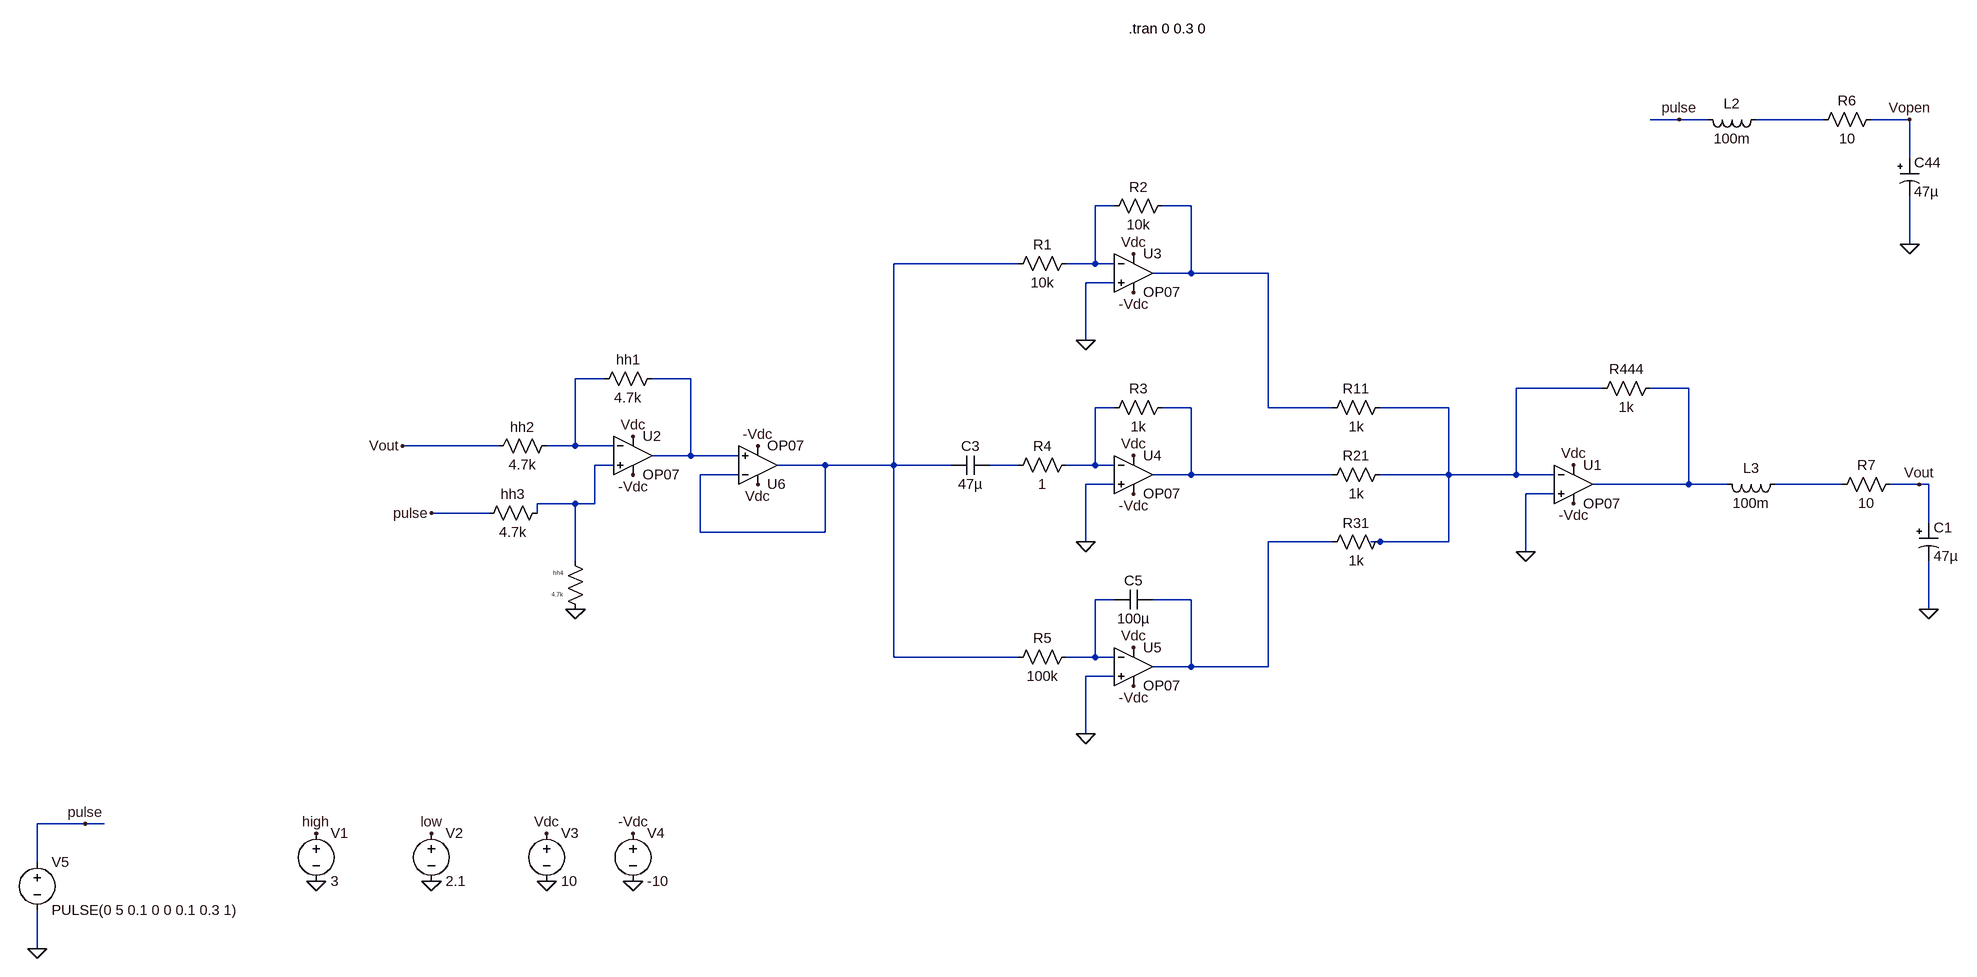
[diagram p0: schematic PID.asc]
PID.asc, the LTspice schematic file:
Version 4
SHEET 1 1540 1184
WIRE 1008 -512 960 -512
WIRE 1056 -512 1008 -512
WIRE 1248 -512 1136 -512
WIRE 1392 -512 1328 -512
WIRE 1392 -448 1392 -512
WIRE -240 -368 -272 -368
WIRE -112 -368 -160 -368
WIRE 1392 -304 1392 -384
WIRE -400 -272 -608 -272
WIRE -272 -272 -272 -368
WIRE -272 -272 -320 -272
WIRE -240 -272 -272 -272
WIRE -112 -256 -112 -368
WIRE -112 -256 -176 -256
WIRE 160 -256 -112 -256
WIRE -240 -240 -288 -240
WIRE -288 -144 -288 -240
WIRE -1312 -80 -1360 -80
WIRE -1168 -80 -1232 -80
WIRE 880 -64 736 -64
WIRE 1024 -64 960 -64
WIRE -240 -32 -272 -32
WIRE -112 -32 -160 -32
WIRE 160 -32 160 -256
WIRE 368 -32 160 -32
WIRE 624 -32 448 -32
WIRE -1488 32 -1648 32
WIRE -1360 32 -1360 -80
WIRE -1360 32 -1408 32
WIRE -1296 32 -1360 32
WIRE -1168 48 -1168 -80
WIRE -1168 48 -1232 48
WIRE -1088 48 -1168 48
WIRE -1296 64 -1328 64
WIRE -944 64 -1024 64
WIRE -608 64 -608 -272
WIRE -608 64 -944 64
WIRE -512 64 -608 64
WIRE -400 64 -448 64
WIRE -272 64 -272 -32
WIRE -272 64 -320 64
WIRE -240 64 -272 64
WIRE -1088 80 -1152 80
WIRE -112 80 -112 -32
WIRE -112 80 -176 80
WIRE 368 80 -112 80
WIRE 624 80 624 -32
WIRE 624 80 448 80
WIRE 736 80 736 -64
WIRE 736 80 624 80
WIRE 800 80 736 80
WIRE -240 96 -288 96
WIRE 1024 96 1024 -64
WIRE 1024 96 864 96
WIRE 1088 96 1024 96
WIRE 1280 96 1168 96
WIRE 1408 96 1360 96
WIRE 1424 96 1408 96
WIRE 800 112 752 112
WIRE -1360 128 -1424 128
WIRE -1328 128 -1328 64
WIRE -1328 128 -1360 128
WIRE -1504 144 -1600 144
WIRE -1424 144 -1424 128
WIRE 1424 160 1424 96
WIRE -1152 176 -1152 80
WIRE -944 176 -944 64
WIRE -944 176 -1152 176
WIRE -288 192 -288 96
WIRE 368 192 160 192
WIRE 448 192 432 192
WIRE 624 192 624 80
WIRE 624 192 448 192
WIRE 752 208 752 112
WIRE -1360 224 -1360 128
WIRE -240 288 -272 288
WIRE -112 288 -176 288
WIRE 1424 304 1424 224
WIRE -608 384 -608 64
WIRE -400 384 -608 384
WIRE -272 384 -272 288
WIRE -272 384 -320 384
WIRE -240 384 -272 384
WIRE -112 400 -112 288
WIRE -112 400 -176 400
WIRE 160 400 160 192
WIRE 160 400 -112 400
WIRE -240 416 -288 416
WIRE -288 512 -288 416
WIRE -2432 960 -2512 960
WIRE -2400 960 -2432 960
WIRE -2512 1024 -2512 960
WIRE -2512 1168 -2512 1104
FLAG 752 208 0
FLAG -1792 1056 0
FLAG -1792 976 high
FLAG -1600 1056 0
FLAG -1600 976 low
FLAG -1408 1056 0
FLAG -1408 976 Vdc
FLAG -1264 1056 0
FLAG -1264 976 -Vdc
FLAG 832 64 Vdc
FLAG 832 128 -Vdc
FLAG -208 -288 Vdc
FLAG -208 -224 -Vdc
FLAG -288 -144 0
FLAG -208 48 Vdc
FLAG -208 112 -Vdc
FLAG -288 192 0
FLAG -208 368 Vdc
FLAG -208 432 -Vdc
FLAG -288 512 0
FLAG -2512 1168 0
FLAG -2432 960 pulse
FLAG -1360 304 0
FLAG -1264 16 Vdc
FLAG -1600 144 pulse
FLAG -1264 80 -Vdc
FLAG -1056 96 Vdc
FLAG -1056 32 -Vdc
FLAG -1648 32 Vout
FLAG 1392 -304 0
FLAG 1008 -512 pulse
FLAG 1424 304 0
FLAG 1408 96 Vout
FLAG 1392 -512 Vopen
SYMBOL res 464 -48 R90
WINDOW 0 0 56 VBottom 2
WINDOW 3 32 56 VTop 2
SYMATTR InstName R11
SYMATTR Value 1k
SYMBOL res 464 64 R90
WINDOW 0 0 56 VBottom 2
WINDOW 3 32 56 VTop 2
SYMATTR InstName R21
SYMATTR Value 1k
SYMBOL res 464 176 R90
WINDOW 0 0 56 VBottom 2
WINDOW 3 32 56 VTop 2
SYMATTR InstName R31
SYMATTR Value 1k
SYMBOL Opamps/OP07 832 32 R0
SYMATTR InstName U1
SYMBOL voltage -1792 960 R0
SYMATTR InstName V1
SYMATTR Value 3
SYMBOL voltage -1600 960 R0
SYMATTR InstName V2
SYMATTR Value 2.1
SYMBOL voltage -1408 960 R0
SYMATTR InstName V3
SYMATTR Value 10
SYMBOL voltage -1264 960 R0
SYMATTR InstName V4
SYMATTR Value -10
SYMBOL res 976 -80 R90
WINDOW 0 0 56 VBottom 2
WINDOW 3 32 56 VTop 2
SYMATTR InstName R444
SYMATTR Value 1k
SYMBOL Opamps/OP07 -208 -320 R0
SYMATTR InstName U3
SYMBOL res -304 -288 R90
WINDOW 0 0 56 VBottom 2
WINDOW 3 32 56 VTop 2
SYMATTR InstName R1
SYMATTR Value 10k
SYMBOL res -144 -384 R90
WINDOW 0 0 56 VBottom 2
WINDOW 3 32 56 VTop 2
SYMATTR InstName R2
SYMATTR Value 10k
SYMBOL Opamps/OP07 -208 16 R0
SYMATTR InstName U4
SYMBOL res -304 48 R90
WINDOW 0 0 56 VBottom 2
WINDOW 3 32 56 VTop 2
SYMATTR InstName R4
SYMATTR Value 1
SYMBOL res -144 -48 R90
WINDOW 0 0 56 VBottom 2
WINDOW 3 32 56 VTop 2
SYMATTR InstName R3
SYMATTR Value 1k
SYMBOL Opamps/OP07 -208 336 R0
SYMATTR InstName U5
SYMBOL res -304 368 R90
WINDOW 0 0 56 VBottom 2
WINDOW 3 32 56 VTop 2
SYMATTR InstName R5
SYMATTR Value 100k
SYMBOL voltage -2512 1008 R0
SYMATTR InstName V5
SYMATTR Value PULSE(0 5 0.1 0 0 0.1 0.3 1)
SYMBOL res -1216 -96 R90
WINDOW 0 0 56 VBottom 2
WINDOW 3 32 56 VTop 2
SYMATTR InstName hh1
SYMATTR Value 4.7k
SYMBOL res -1392 16 R90
WINDOW 0 0 56 VBottom 2
WINDOW 3 32 56 VTop 2
SYMATTR InstName hh2
SYMATTR Value 4.7k
SYMBOL res -1408 128 R90
WINDOW 0 0 56 VBottom 2
WINDOW 3 32 56 VTop 2
SYMATTR InstName hh3
SYMATTR Value 4.7k
SYMBOL res -1344 320 R180
WINDOW 0 36 76 Left 0
WINDOW 3 36 40 Left 0
SYMATTR InstName hh4
SYMATTR Value 4.7k
SYMBOL Opamps/OP07 -1264 -16 R0
SYMATTR InstName U2
SYMBOL Opamps/OP07 -1056 128 M180
SYMATTR InstName U6
SYMBOL res 1344 -528 R90
WINDOW 0 0 56 VBottom 2
WINDOW 3 32 56 VTop 2
SYMATTR InstName R6
SYMATTR Value 10
SYMBOL ind 1152 -528 R90
WINDOW 0 5 56 VBottom 2
WINDOW 3 32 56 VTop 2
SYMATTR InstName L2
SYMATTR Value 100m
SYMBOL polcap 1376 -448 R0
SYMATTR InstName C44
SYMATTR Value 47µ
SYMBOL cap -448 48 R90
WINDOW 0 0 32 VBottom 2
WINDOW 3 32 32 VTop 2
SYMATTR InstName C3
SYMATTR Value 47µ
SYMBOL cap -176 272 R90
WINDOW 0 0 32 VBottom 2
WINDOW 3 32 32 VTop 2
SYMATTR InstName C5
SYMATTR Value 100µ
SYMBOL res 1376 80 R90
WINDOW 0 0 56 VBottom 2
WINDOW 3 32 56 VTop 2
SYMATTR InstName R7
SYMATTR Value 10
SYMBOL ind 1184 80 R90
WINDOW 0 5 56 VBottom 2
WINDOW 3 32 56 VTop 2
SYMATTR InstName L3
SYMATTR Value 100m
SYMBOL polcap 1408 160 R0
SYMATTR InstName C1
SYMATTR Value 47µ
TEXT -216 -952 Left 2 !.tran 0 0.3 0

The netlist it stands for:
* PID.asc
R11 N007 N003 1k
R21 N007 N010 1k
R31 N007 N014 1k
XU1 0 N007 Vdc -Vdc N008 LT1001  ; OP07, pins In+ In- V+ V- OUT
V1 high 0 3
V2 low 0 2.1
V3 Vdc 0 10
V4 -Vdc 0 -10
R444 N008 N007 1k
XU3 0 N002 Vdc -Vdc N003 LT1001  ; OP07, pins In+ In- V+ V- OUT
R1 N002 N004 10k
R2 N003 N002 10k
XU4 0 N009 Vdc -Vdc N010 LT1001  ; OP07, pins In+ In- V+ V- OUT
R4 N009 N012 1
R3 N010 N009 1k
XU5 0 N015 Vdc -Vdc N014 LT1001  ; OP07, pins In+ In- V+ V- OUT
R5 N015 N004 100k
V5 pulse 0 PULSE(0 5 0.1 0 0 0.1 0.3 1)
R§hh1 N006 N005 4.7k
R§hh2 N005 Vout 4.7k
R§hh3 N011 pulse 4.7k
R§hh4 0 N011 4.7k
XU2 N011 N005 Vdc -Vdc N006 LT1001  ; OP07, pins In+ In- V+ V- OUT
XU6 N006 N004 Vdc -Vdc N004 LT1001  ; OP07, pins In+ In- V+ V- OUT
R6 Vopen N001 10
L2 N001 pulse 100m
C44 Vopen 0 47µ
C3 N012 N004 47µ
C5 N014 N015 100µ
R7 Vout N013 10
L3 N013 N008 100m
C1 Vout 0 47µ
.tran 0 0.3 0
.lib LTC.lib
.backanno
.end